# Altium schematic sheet UART_CH340G.SchDoc
size A4; SheetNumber: 7; SheetTotal: 7
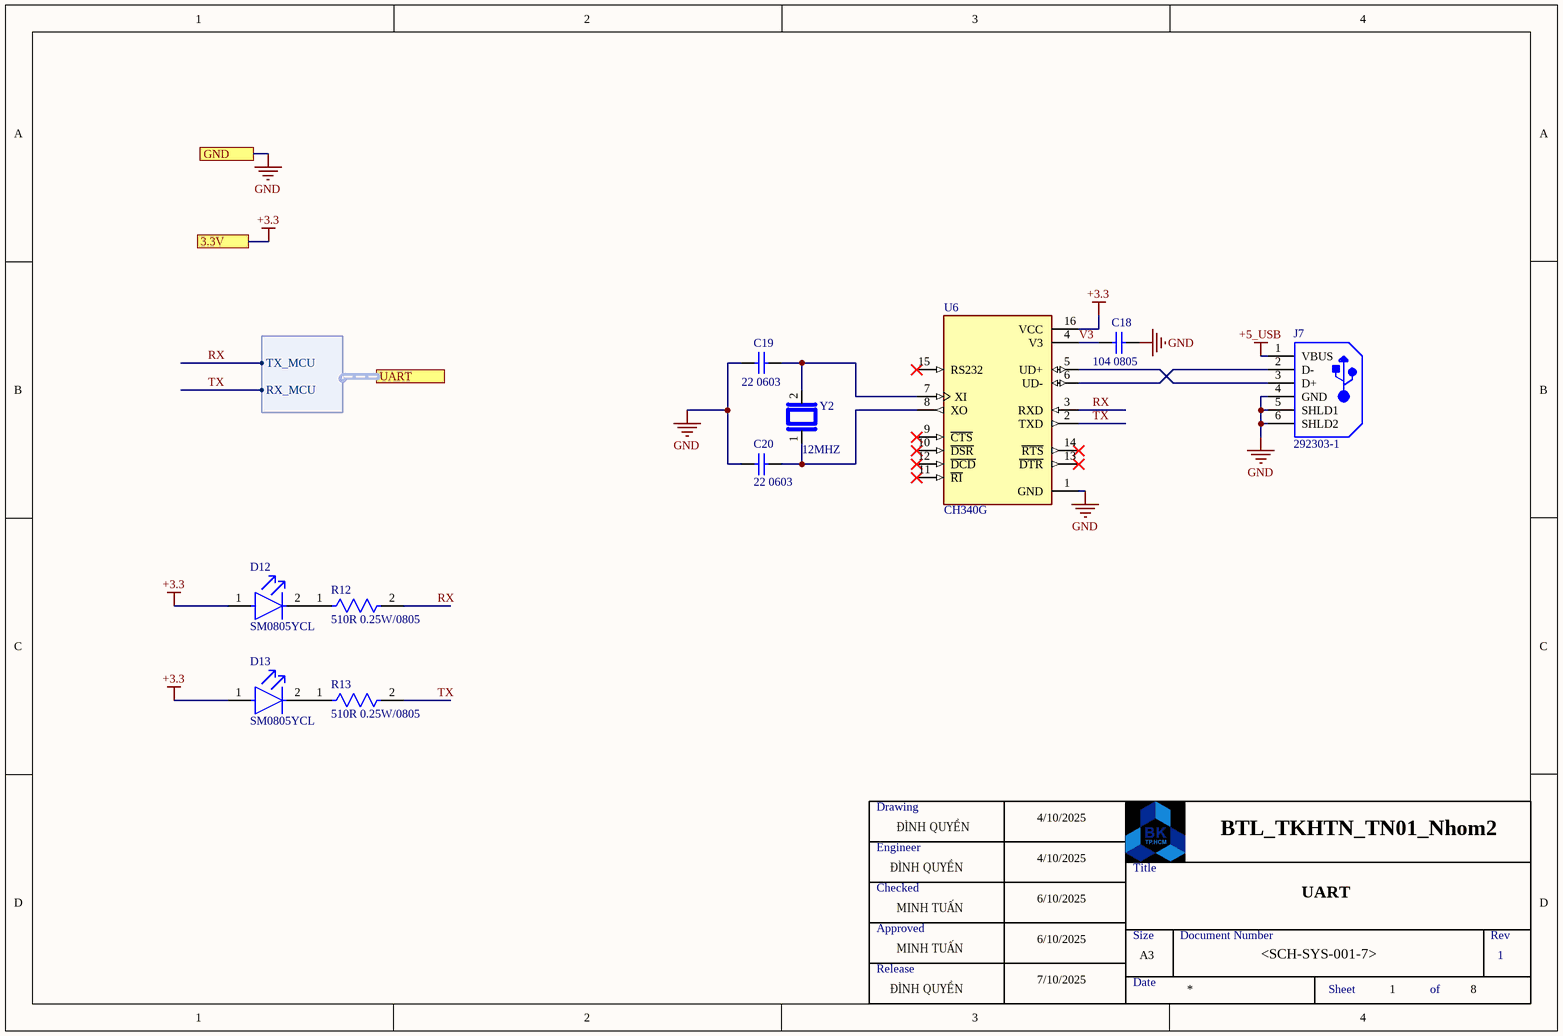
[diagram p0: UART_CH340G.SchDoc]

## Parts
C18  104 0805  [CAPC0805(2012)145_M]
C19  22 0603  [CAPC1608X92X38ML15T08]
C20  22 0603  [CAPC1608X92X38ML15T08]
D12  SM0805YCL  [FP-SM0805YCL-MFG]
D13  SM0805YCL  [FP-SM0805YCL-MFG]
J7  292303-1  [TE-292303-1_V]
R12  510R 0.25W/0805  [FP-AF0805-IPC_C]
R13  510R 0.25W/0805  [FP-AF0805-IPC_C]
U6  CH340G  [SOIC127P600X180-16N]
Y2  12MHZ  [XTAL_HC49P488W43L1150T466H350]

## Ports
3.3V (see DC_MOTOR_CONTROLLER[4B], 78M05_RT9193[2A], Led_Button[1A], Microcontroller[1A]), GND (see DC_MOTOR_CONTROLLER[4B], 78M05_RT9193[2A], L298N_Motor[1C], Led_Button[1A], Microcontroller[1A]), UART (harness UART, see DC_MOTOR_CONTROLLER[3B], Microcontroller[1C])

## Harnesses
UART: TX_MCU, RX_MCU

## Nets
+3.3: D12.1(A) D13.1(A) U6.16(VCC) ; port 3.3V
+5_USB: J7.1(VBUS)
GND: C18.2 C19.2 C20.2 J7.4(GND) J7.5(SHLD1) J7.6(SHLD2) U6.1(GND) ; port GND
RX: R12.2 U6.3(RXD) ; port UART.TX_MCU
TX: R13.2 U6.2(TXD) ; port UART.RX_MCU
V3: C18.1 U6.4(V3)
NetC19_1: C19.1 U6.7(XI) Y2.2
NetC20_1: C20.1 U6.8(XO) Y2.1
NetD12_2: D12.2(C) R12.1
NetD13_2: D13.2(C) R13.1
NetJ7_2: J7.2(D-) U6.6(UD-)
NetJ7_3: J7.3(D+) U6.5(UD+)

Not connected (* = marked no-connect by the designer): U6 9(~{CTS})* 10(~{DSR})* 11(~{RI})* 12(~{DCD})* 13(~{DTR})* 14(~{RTS})* 15(RS232)*

## Notes on the sheet
- Drawing
- Engineer
- ĐÌNH QUYỀN
- 4/10/2025
- BTL_TKHTN_TN01_Nhom2
- Checked
- MINH TUẤN
- 6/10/2025
- Title
- UART
- Approved
- Release
- 7/10/2025
- Size
- Date
- A3
- Document Number
- <SCH-SYS-001-7>
- Rev
- 1
- Sheet
- of
- 8

## Library data of the parts
C18 = CMP-1036-03968-1: CAP 15nF 100V ±10% 0805 (2012 Metric) Thickness 1.45mm SMD; Tolerance: Â±10%; Case-Metric: 2012; Case-EIA: 0805; Rated Voltage: 100 V; Max Thickness: 1.45 mm; Technology: SMT; Value: 15nF
C19 C20 = CMP-2006-01201-1: Manufacturer: Vitramon; Part Number: VJ0603Y103JXXAC
D12 D13 = CMP-35283-000007-1: LED YELLOW CLEAR 0805 SMD; Luminous Intensity: 11.5mcd; Test Current: 2mA; Viewing Angle: 130°; Dominant Wavelength: 592nm; Forward Voltage: 1.9V; Lens Color: Colorless; Case Code (Metric): 2012; Illumination Color: Yellow; Length: 2mm; Max Operating Temperature: 80°C; Width: 1.2mm; Case Code (Imperial): 0805; Packaging: Tape and Reel; Lens Transparency: Clear; Mount: Surface Mount; Case/Package: 0805; Forward Current: 2mA; Height: 0.8mm; Lead Free: Lead Free; Min Operating Temperature: -30°C; Color: Yellow; Package Quantity: 4000
J7 = CMP-2000-05404-1: 1 Port Right Angle Through Hole Mount Female Type A USB Connector, 4 Position, -55 to 85 degC, RoHS, Tube; Manufacturer: TE Connectivity; Contact Termination Type: Solder; No. of Contacts: 4; Connector Mounting: PCB; SVHC: NoSVHC(16-Jun-2014); Gender: Receptacle; Connector Type: USBA; Package Description: 4-Pin Through Hole Device, Body 14 x 13.13 mm, Pitch 2.5 mm; Contact Plating: Gold; Package Reference: 292303-1; Contact Material: Copper; Datasheet URL: http://www.farnell.com/cad/1653030.pdf; Datasheet Version: Feb-12; Manufacturer URL: http://www.te.com/
R12 R13 = CMP-03412-045285-1: Anti-Sulfurated Chip Resistor Automotive Grade 75Ω 1% 0.125W ±100ppm/°C 0805; Max Power Dissipation: 125mW; Resistance: 75R; Resistor Type: Thick Film; Number of Terminations: 2; Min Operating Temperature: -55°C; Packaging: Tape and Reel; Height: 0.024inch; Max Operating Temperature: 155°C; Series: AF; Case/Package: 0805; Tolerance: 1%; Length: 0.079inch; Width: 0.049inch; Features: Moisture Resistant; RoHS Compliant: Yes; Temperature Coefficient: 100ppm/°C
U6 = CH340G: USB Interface Integrated Circuit; MF: WCH; Value: *; SnapEDA_Link: https://www.snapeda.com/parts/Ch340G/WCH/view-part/?ref=snap; MP: Ch340G; Check_prices: https://www.snapeda.com/parts/Ch340G/WCH/view-part/?ref=eda; Availability: Not in stock; Price: None; Package: None
Y2 = HC-49/U-S16000000ABJB: 16 MHz Â±30ppm Crystal 18pF 50 Ohms HC-49/US; MF: Citizen Finedevice; SnapEDA_Link: https://www.snapeda.com/parts/HC-49/U-S16000000ABJB/Citizen/view-part/?ref=snap; Package: HC-49/US Citizen Finetech Miyota; Value: *; MP: HC-49/U-S16000000ABJB; Check_prices: https://www.snapeda.com/parts/HC-49/U-S16000000ABJB/Citizen/view-part/?ref=eda